# Altium project Charger_Power_2026_v2.PrjPcb
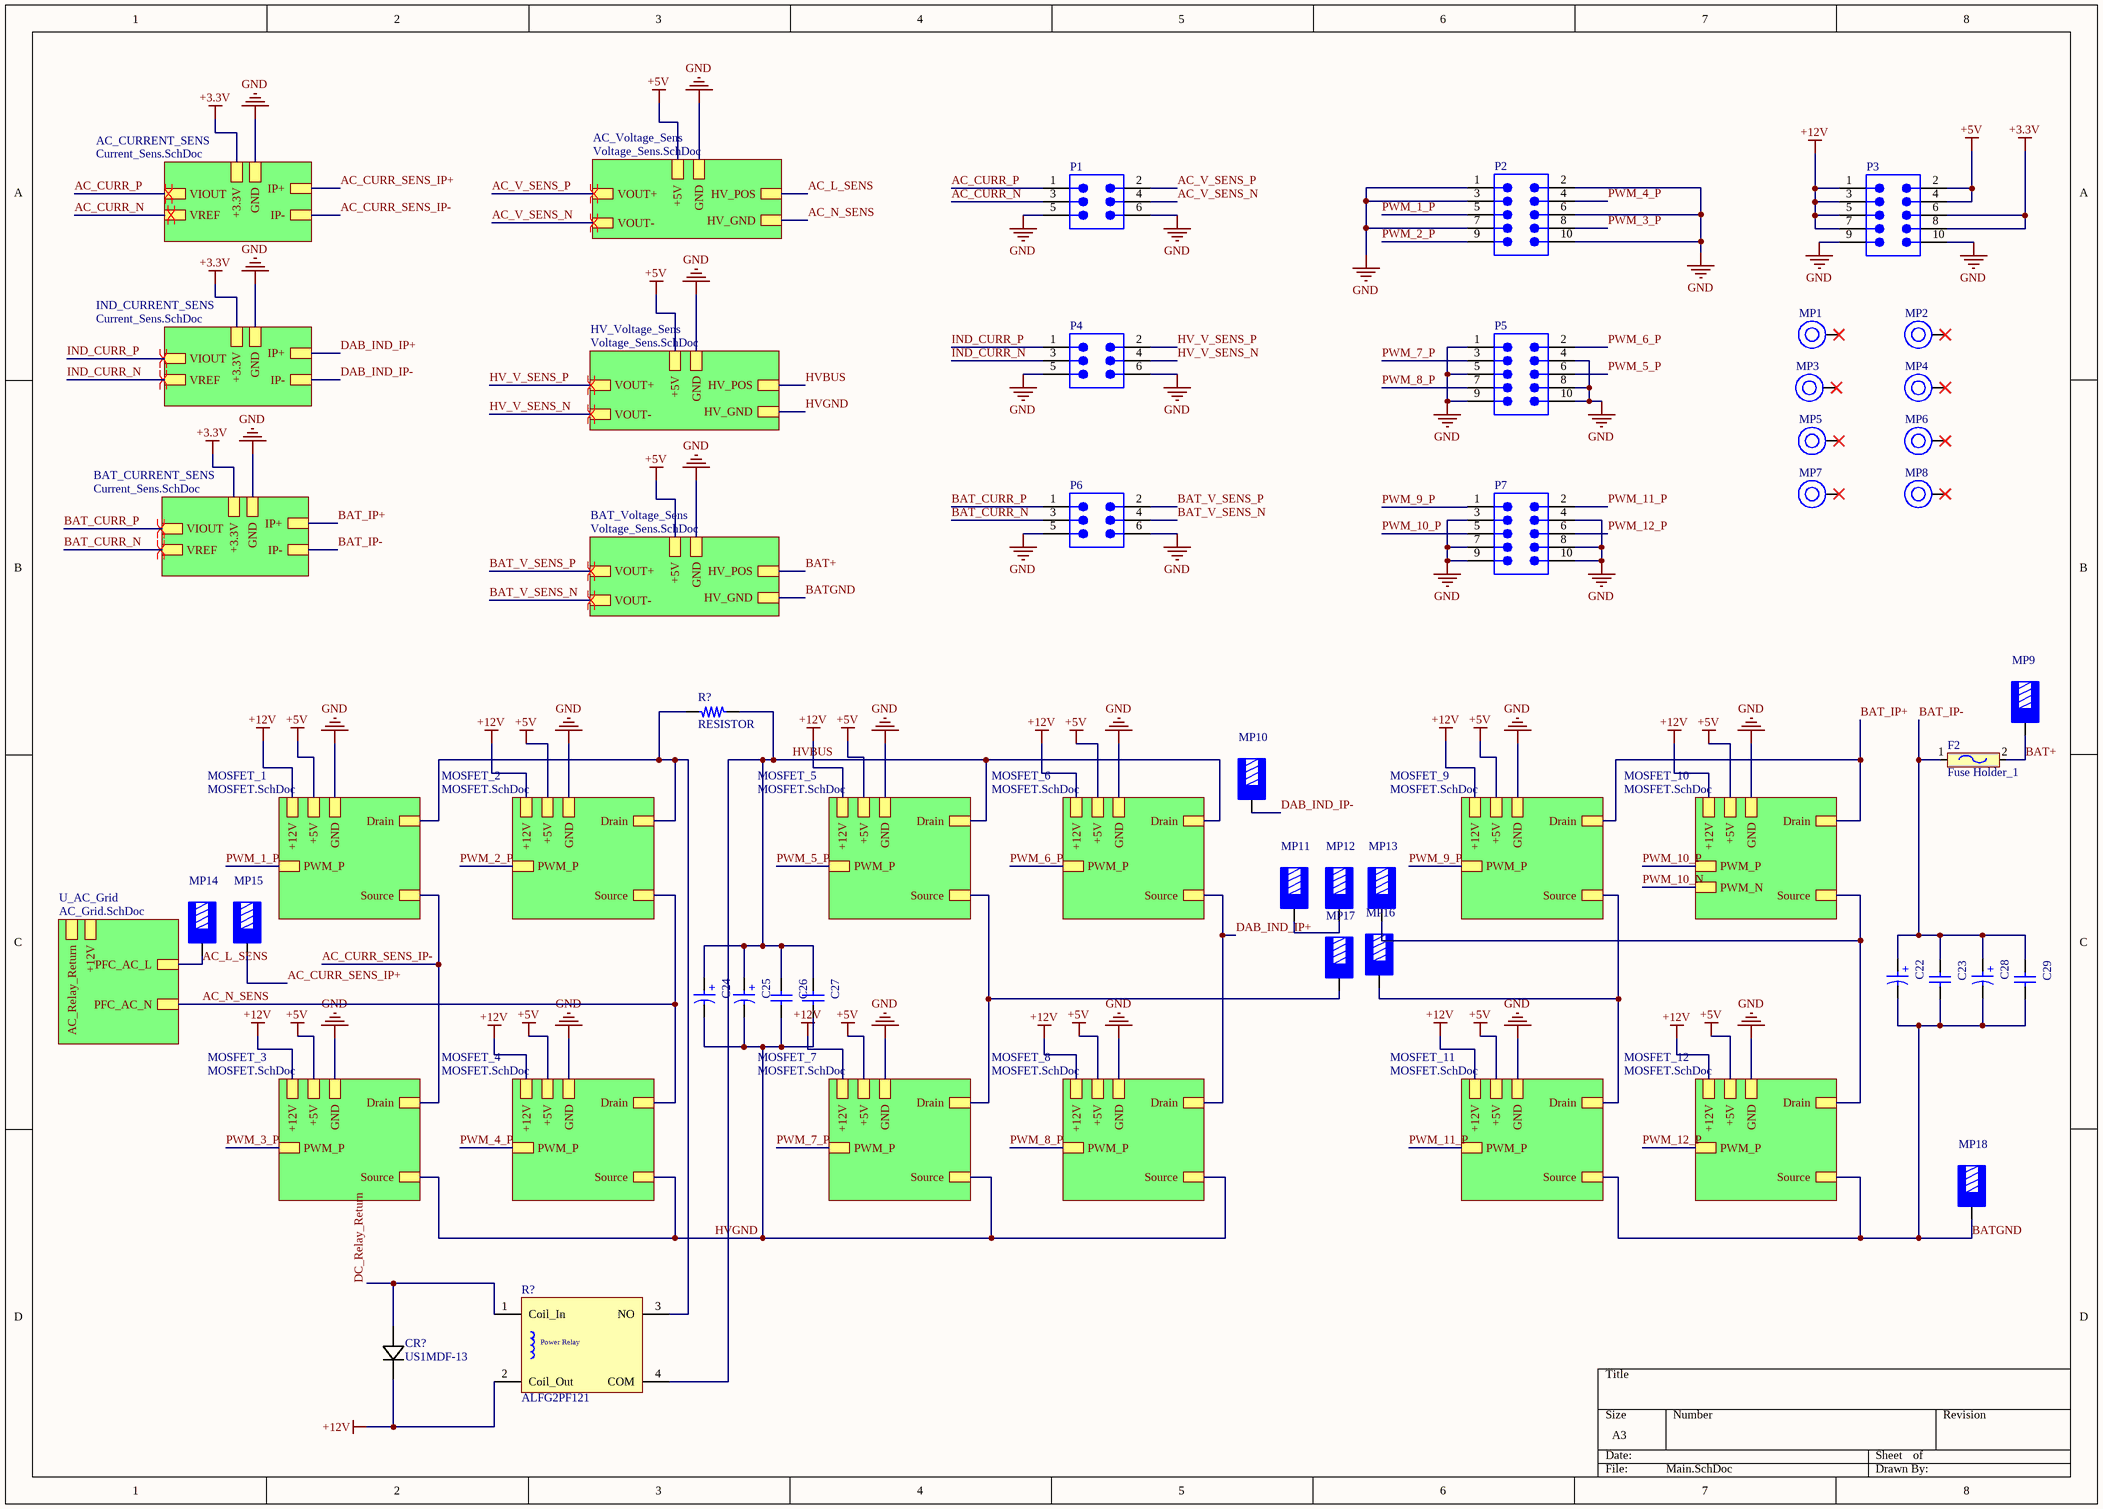
[diagram p0: Main.SchDoc]
5 sheets, 365 parts. Net scope: strictly hierarchical (ports join the sheet entries above them; power ports are local).
Board file: PCB1.PcbDoc
Sheets:
  Main.SchDoc
    U_AC_Grid = AC_Grid.SchDoc
    MOSFET_1 = MOSFET.SchDoc
    AC_Voltage_Sens = Voltage_Sens.SchDoc
    MOSFET_3 = MOSFET.SchDoc
    MOSFET_2 = MOSFET.SchDoc
    MOSFET_4 = MOSFET.SchDoc
    MOSFET_5 = MOSFET.SchDoc
    MOSFET_7 = MOSFET.SchDoc
    MOSFET_6 = MOSFET.SchDoc
    MOSFET_8 = MOSFET.SchDoc
    MOSFET_9 = MOSFET.SchDoc
    MOSFET_11 = MOSFET.SchDoc
    MOSFET_10 = MOSFET.SchDoc
    MOSFET_12 = MOSFET.SchDoc
    AC_CURRENT_SENS = Current_Sens.SchDoc
    IND_CURRENT_SENS = Current_Sens.SchDoc
    BAT_CURRENT_SENS = Current_Sens.SchDoc
    HV_Voltage_Sens = Voltage_Sens.SchDoc
    BAT_Voltage_Sens = Voltage_Sens.SchDoc

## Sheet Main.SchDoc
size A3; SheetNumber: 1; SheetTotal: 5; SPICEModelCacheLDJSNXER: <root> / <DocumentId>LDJSNXER</DocumentId> / <CacheFrame Number="0"> / <Model Name="861141486026_680uf" Kind="CKT"> / <Text>******* / .subckt 861141486026_680uF 1 2 / Rser 1 3 0.06 / Lser 2 4 1.05528512515298E-08 / C1 3 4 0.00068 / Rpar 3 4 271162.745854223 / .ends 861141486026_680uF</Text> / </Model> / <Model Name="890263425004cs_2.2uf" Kind="CKT"> / <Text>******* / .subckt 890263425004CS_2.2uF 1 2 / Rser 1 3 0.0196538190645 / Lser 2 4 1.1417797143E-08 / C1 3 4 0.0000022 / Rpar 3 4 1363636363.63636 / .ends 890263425004CS_2.2uF</Text> / </Model> / </CacheFrame> / </root>

### Parts
(Parts that share a designator on the sheet are numbered #1, #2 ... from top to bottom, then left to right.)
C22  680µF  [WCAP-AI3H_D35H55]  (value not drawn)
C23  1.5µF  [WCAP-FTBE_L31W15H24.5]  (value not drawn)
C24  680µF  [WCAP-AI3H_D35H55]  (value not drawn)
C25  680µF  [WCAP-AI3H_D35H55]  (value not drawn)
C26  1.5µF  [WCAP-FTBE_L31W15H24.5]  (value not drawn)
C27  1.5µF  [WCAP-FTBE_L31W15H24.5]  (value not drawn)
C28  680µF  [WCAP-AI3H_D35H55]  (value not drawn)
C29  1.5µF  [WCAP-FTBE_L31W15H24.5]  (value not drawn)
CR?  US1MDF-13  [DIODE_US1MDF-13_DIO-M]
F2  Fuse Holder_1  [Fuse Holder]
MP1  M3 x 10mm  [78614100360]  (value not drawn)
MP2  M3 x 10mm  [78614100360]  (value not drawn)
MP3  M3 x 10mm  [78614100360]  (value not drawn)
MP4  M3 x 10mm  [78614100360]  (value not drawn)
MP5  M3 x 10mm  [78614100360]  (value not drawn)
MP6  M3 x 10mm  [78614100360]  (value not drawn)
MP7  M3 x 10mm  [78614100360]  (value not drawn)
MP8  M3 x 10mm  [78614100360]  (value not drawn)
MP9  M4 x 6mm  [7460307_chemical surface]  (value not drawn)
MP10  M4 x 6mm  [7460307_chemical surface]  (value not drawn)
MP11  M4 x 6mm  [7460307_chemical surface]  (value not drawn)
MP12  M4 x 6mm  [7460307_chemical surface]  (value not drawn)
MP13  M4 x 6mm  [7460307_chemical surface]  (value not drawn)
MP14  M4 x 6mm  [7460307_chemical surface]  (value not drawn)
MP15  M4 x 6mm  [7460307_chemical surface]  (value not drawn)
MP16  M4 x 6mm  [7460307_chemical surface]  (value not drawn)
MP17  M4 x 6mm  [7460307_chemical surface]  (value not drawn)
MP18  M4 x 6mm  [7460307_chemical surface]  (value not drawn)
P1  61300621121  [61300621121]  (value not drawn)
P2  61301021121  [61301021121]  (value not drawn)
P3  61301021121  [61301021121]  (value not drawn)
P4  61300621121  [61300621121]  (value not drawn)
P5  61301021121  [61301021121]  (value not drawn)
P6  61300621121  [61300621121]  (value not drawn)
P7  61301021121  [61301021121]  (value not drawn)
R?#1  RESISTOR  [Power Resistor]
R?#2  ALFG2PF121  [Power Relay]

### Sub-sheets
AC_CURRENT_SENS = Current_Sens.SchDoc: +3.3V, GND, VIOUT, VREF, IP+, IP-
AC_Voltage_Sens = Voltage_Sens.SchDoc: VOUT+, VOUT-, HV_POS, HV_GND, +5V, GND
BAT_CURRENT_SENS = Current_Sens.SchDoc: +3.3V, GND, VIOUT, VREF, IP+, IP-
BAT_Voltage_Sens = Voltage_Sens.SchDoc: VOUT+, VOUT-, HV_POS, HV_GND, +5V, GND
HV_Voltage_Sens = Voltage_Sens.SchDoc: VOUT+, VOUT-, HV_POS, HV_GND, +5V, GND
IND_CURRENT_SENS = Current_Sens.SchDoc: +3.3V, GND, VIOUT, VREF, IP+, IP-
MOSFET_1 = MOSFET.SchDoc: PWM_P, Drain, Source, +12V, +5V, GND
MOSFET_2 = MOSFET.SchDoc: PWM_P, Drain, Source, +12V, +5V, GND
MOSFET_3 = MOSFET.SchDoc: PWM_P, Drain, Source, +12V, +5V, GND
MOSFET_4 = MOSFET.SchDoc: PWM_P, Drain, Source, +12V, +5V, GND
MOSFET_5 = MOSFET.SchDoc: PWM_P, Drain, Source, +12V, +5V, GND
MOSFET_6 = MOSFET.SchDoc: PWM_P, Drain, Source, +12V, +5V, GND
MOSFET_7 = MOSFET.SchDoc: PWM_P, Drain, Source, +12V, +5V, GND
MOSFET_8 = MOSFET.SchDoc: PWM_P, Drain, Source, +12V, +5V, GND
MOSFET_9 = MOSFET.SchDoc: PWM_P, Drain, Source, +12V, +5V, GND
MOSFET_10 = MOSFET.SchDoc: PWM_P, PWM_N, Drain, Source, +12V, +5V, GND
MOSFET_11 = MOSFET.SchDoc: PWM_P, Drain, Source, +12V, +5V, GND
MOSFET_12 = MOSFET.SchDoc: PWM_P, Drain, Source, +12V, +5V, GND
U_AC_Grid = AC_Grid.SchDoc: PFC_AC_L, PFC_AC_N, +12V, AC_Relay_Return

### Nets
+3.3V: P3.6 P3.8 ; sheet AC_CURRENT_SENS/+3.3V, sheet IND_CURRENT_SENS/+3.3V, sheet BAT_CURRENT_SENS/+3.3V
+5V: P3.2 P3.4 ; sheet MOSFET_1/+5V, sheet AC_Voltage_Sens/+5V, sheet MOSFET_3/+5V, sheet MOSFET_2/+5V, sheet MOSFET_4/+5V, sheet MOSFET_5/+5V, sheet MOSFET_7/+5V, sheet MOSFET_6/+5V, sheet MOSFET_8/+5V, sheet MOSFET_9/+5V, sheet MOSFET_11/+5V, sheet MOSFET_10/+5V, sheet MOSFET_12/+5V, sheet HV_Voltage_Sens/+5V, sheet BAT_Voltage_Sens/+5V
+12V: CR?.1 P3.1 P3.3 P3.5 P3.7 R?#2.2(Coil_Out) ; sheet MOSFET_1/+12V, sheet MOSFET_3/+12V, sheet MOSFET_2/+12V, sheet MOSFET_4/+12V, sheet MOSFET_5/+12V, sheet MOSFET_7/+12V, sheet MOSFET_6/+12V, sheet MOSFET_8/+12V, sheet MOSFET_9/+12V, sheet MOSFET_11/+12V, sheet MOSFET_10/+12V, sheet MOSFET_12/+12V
AC_L_SENS: MP14.1 ; sheet U_AC_Grid/PFC_AC_L, sheet AC_Voltage_Sens/HV_POS
AC_N_SENS: sheet U_AC_Grid/PFC_AC_N, sheet AC_Voltage_Sens/HV_GND, sheet MOSFET_2/Source, sheet MOSFET_4/Drain
BAT+: F2.2(VCC26) MP9.1 ; sheet BAT_Voltage_Sens/HV_POS
BATGND: C22.2(N) C23.2 C28.2(N) C29.2 MP18.1 ; sheet MOSFET_11/Source, sheet MOSFET_12/Source, sheet BAT_Voltage_Sens/HV_GND
GND: P1.5 P1.6 P2.1 P2.2 P2.3 P2.6 P2.7 P2.10 P3.9 P3.10 P4.5 P4.6 P5.1 P5.4 P5.5 P5.8 P5.9 P5.10 P6.5 P6.6 P7.3 P7.4 P7.7 P7.8 P7.9 P7.10 ; sheet MOSFET_1/GND, sheet AC_Voltage_Sens/GND, sheet MOSFET_3/GND, sheet MOSFET_2/GND, sheet MOSFET_4/GND, sheet MOSFET_5/GND, sheet MOSFET_7/GND, sheet MOSFET_6/GND, sheet MOSFET_8/GND, sheet MOSFET_9/GND, sheet MOSFET_11/GND, sheet MOSFET_10/GND, sheet MOSFET_12/GND, sheet AC_CURRENT_SENS/GND, sheet IND_CURRENT_SENS/GND, sheet BAT_CURRENT_SENS/GND, sheet HV_Voltage_Sens/GND, sheet BAT_Voltage_Sens/GND
HVBUS: C24.1(P) C25.1(P) C26.1 C27.1 R?#1.2(BOT) R?#2.4(COM) ; sheet MOSFET_5/Drain, sheet MOSFET_6/Drain, sheet HV_Voltage_Sens/HV_POS
HVGND: C24.2(N) C25.2(N) C26.2 C27.2 ; sheet MOSFET_3/Source, sheet MOSFET_4/Source, sheet MOSFET_7/Source, sheet MOSFET_8/Source, sheet HV_Voltage_Sens/HV_GND
AC_CURR_N: P1.3 ; sheet AC_CURRENT_SENS/VREF
AC_CURR_P: P1.1 ; sheet AC_CURRENT_SENS/VIOUT
AC_CURR_SENS_IP+: MP15.1 ; sheet AC_CURRENT_SENS/IP+
AC_CURR_SENS_IP-: sheet MOSFET_1/Source, sheet MOSFET_3/Drain, sheet AC_CURRENT_SENS/IP-
AC_V_SENS_N: P1.4 ; sheet AC_Voltage_Sens/VOUT-
AC_V_SENS_P: P1.2 ; sheet AC_Voltage_Sens/VOUT+
BAT_CURR_N: P6.3 ; sheet BAT_CURRENT_SENS/VREF
BAT_CURR_P: P6.1 ; sheet BAT_CURRENT_SENS/VIOUT
BAT_IP+: sheet MOSFET_9/Drain, sheet MOSFET_10/Drain, sheet BAT_CURRENT_SENS/IP+
BAT_IP-: C22.1(P) C23.1 C28.1(P) C29.1 F2.1(VCC27) ; sheet BAT_CURRENT_SENS/IP-
BAT_V_SENS_N: P6.4 ; sheet BAT_Voltage_Sens/VOUT-
BAT_V_SENS_P: P6.2 ; sheet BAT_Voltage_Sens/VOUT+
DAB_IND_IP+: sheet MOSFET_6/Source, sheet MOSFET_8/Drain, sheet IND_CURRENT_SENS/IP+
DAB_IND_IP-: MP10.1 ; sheet IND_CURRENT_SENS/IP-
DC_Relay_Return: CR?.2 R?#2.1(Coil_In)
Drain: MP17.1 ; sheet MOSFET_5/Source, sheet MOSFET_7/Drain
Drain: MP13.1 ; sheet MOSFET_10/Source, sheet MOSFET_12/Drain  [a separate net that carries the same name]
Drain: MP16.1 ; sheet MOSFET_9/Source, sheet MOSFET_11/Drain  [a separate net that carries the same name]
Drain: R?#1.1(TOP) R?#2.3(NO) ; sheet MOSFET_1/Drain, sheet MOSFET_2/Drain  [a separate net that carries the same name]
HV_V_SENS_N: P4.4 ; sheet HV_Voltage_Sens/VOUT-
HV_V_SENS_P: P4.2 ; sheet HV_Voltage_Sens/VOUT+
IND_CURR_N: P4.3 ; sheet IND_CURRENT_SENS/VREF
IND_CURR_P: P4.1 ; sheet IND_CURRENT_SENS/VIOUT
PWM_1_P: P2.5 ; sheet MOSFET_1/PWM_P
PWM_2_P: P2.9 ; sheet MOSFET_2/PWM_P
PWM_3_P: P2.8 ; sheet MOSFET_3/PWM_P
PWM_4_P: P2.4 ; sheet MOSFET_4/PWM_P
PWM_5_P: P5.6 ; sheet MOSFET_5/PWM_P
PWM_6_P: P5.2 ; sheet MOSFET_6/PWM_P
PWM_7_P: P5.3 ; sheet MOSFET_7/PWM_P
PWM_8_P: P5.7 ; sheet MOSFET_8/PWM_P
PWM_9_P: P7.1 ; sheet MOSFET_9/PWM_P
PWM_10_N: sheet MOSFET_10/PWM_N
PWM_10_P: P7.5 ; sheet MOSFET_10/PWM_P
PWM_11_P: P7.2 ; sheet MOSFET_11/PWM_P
PWM_12_P: P7.6 ; sheet MOSFET_12/PWM_P
NetMP11_1: MP11.1 MP12.1

Not connected (* = marked no-connect by the designer): MP1 1*; MP2 1*; MP3 1*; MP4 1*; MP5 1*; MP6 1*; MP7 1*; MP8 1*

### Layout directives
differential pair: AC_CURR_N, AC_CURR_P, AC_V_SENS_N, AC_V_SENS_P, BAT_CURR_N, BAT_CURR_P, BAT_V_SENS_N, BAT_V_SENS_P, HV_V_SENS_N, HV_V_SENS_P, IND_CURR_N, IND_CURR_P

### Notes on the sheet
- (in symbol 861141486026) +

### Library data of the parts
C22 C24 C25 C28 = 861141486026: WCAP-AI3H Aluminum Electrolytic Capacitor, THT, D35 x H55mm, 680µF, 450V; Manufacturer: Wurth Elektronik; Dissipation Factor: 20%; Endurance: 3000h; Leakage Current: 1659.52µA; Ripple Current: 2200mA; Manufacturer Part Number: 861141486026; Category: Aluminum Electrolytic Capacitors; Match Code: WCAP-AI3H; ComponentLink1Description: Website Link; ComponentLink1URL: https://www.we-online.com/redexpert/article/861141486026?ad; ComponentLink2Description: Datasheet Link; ComponentLink2URL: https://www.we-online.com/redexpert/spec/861141486026?ad; Mount: Through Hole; Min Operating Temperature: -25°C; Max Operating Temperature: 105°C; Packaging: Tray; Height: 55mm; Diameter: 35mm; Capacitance: 680µF; Lead Pitch: 10mm; Rated Voltage (DC): 450V
C23 C26 C27 C29 = 890303427009CS: WCAP-FTBE Film Capacitor, THT, L31 x W15 x H24.5mm, 1.5µF, 630V; Manufacturer: Wurth Elektronik; Dissipation Factor @1kHz: 1%; Insulation Resistance: 2GΩ; Rate of Voltage Rise: 17V/µs; Rated Voltage @85degC: 630V (DC); Rated Voltage @105degC: 504V (DC); Manufacturer Part Number: 890303427009CS; Category: Film Capacitors; Match Code: WCAP-FTBE; ComponentLink1Description: Website Link; ComponentLink1URL: https://www.we-online.com/redexpert/article/890303427009CS?ad; ComponentLink2Description: Datasheet Link; ComponentLink2URL: https://www.we-online.com/redexpert/spec/890303427009CS?ad; Mount: Through Hole; Min Operating Temperature: -40°C; Max Operating Temperature: 85°C; Packaging: Carton; Length: 31mm; Width: 15mm; Height: 24.5mm; Capacitance: 1.5µF
CR? = US1MDF-13: No Description Available; Mfr_Name: Diodes Inc; Type: DEV; Copyright: Copyright (C) 2021 Ultra Librarian. All rights reserved.; Manufacturer_Part_Number: US1MDF-13; RefDes: RefDes
MP1-MP8 = 78614100360: WA-SMSA SMT Spacer Studs Automotive, OD 6mm, ID 4.2mm, M3 x 10mm; Manufacturer: Wurth Elektronik; Surface: Tin; Solder Cream Thickness Min: 150um; Tightenning Torque Max: 0.5N*m; Manufacturer Part Number: 78614100360; Category: SMT Spacers; Match Code: WA-SMSA; ComponentLink1Description: Website Link; ComponentLink1URL: https://www.we-online.com/redexpert/article/78614100360?ad; ComponentLink2Description: Datasheet Link; ComponentLink2URL: https://www.we-online.com/redexpert/spec/78614100360?ad; Mount: Surface Mount; Min Operating Temperature: -55°C; Max Operating Temperature: 150°C; Packaging: Tape and Reel; Height: 10mm; Automotive: Yes; Inside Diameter: 4.2mm; Material: Steel; Outside Diameter: 6mm; Thread Size: M3
MP9-MP18 = 7460307: WP-BUTR REDCUBE PRESS-FIT with internal thread, two-rows, L9W9H7mm, M4 x 6mm, 160A; Manufacturer: Wurth Elektronik; Surface: Tin; Manufacturer Part Number: 7460307; Category: REDCUBE PRESS-FIT; Match Code: WP-BUTR; ComponentLink1Description: Website Link; ComponentLink1URL: https://www.we-online.com/redexpert/article/7460307?ad; ComponentLink2Description: Datasheet Link; ComponentLink2URL: https://www.we-online.com/redexpert/spec/7460307?ad; Mount: Press Fit; Min Operating Temperature: -55°C; Max Operating Temperature: 150°C; Packaging: Bulk; Length: 9mm; Width: 9mm; Height: 7mm; Material: Brass; Number of Pins: 8; Rated Current: 160A; Thread Length: 6mm; Thread Size: M4
P1 P4 P6 = 61300621121: WR-PHD Pin Header, THT, Vertical, pitch 2.54mm, 2 Row, 6P; Manufacturer: Wurth Elektronik; Contact Resistance: 20mOhm; Rated Current: 3A; Working Voltage: 250V; Withstanding Voltage: 500V; Manufacturer Part Number: 61300621121; Category: Board-to-Board Connectors; Match Code: WR-PHD; ComponentLink1Description: Website Link; ComponentLink1URL: https://www.we-online.com/redexpert/article/61300621121?ad; ComponentLink2Description: Datasheet Link; ComponentLink2URL: https://www.we-online.com/redexpert/spec/61300621121?ad; Mount: Through Hole; Min Operating Temperature: -40°C; Max Operating Temperature: 105°C; Packaging: Bag; Gender: Pin Header; Number of Pins: 6; Number of Rows: 2; Orientation: Vertical; Lead Pitch: 2.54mm
P2 P3 P5 P7 = 61301021121: WR-PHD Pin Header, THT, Vertical, pitch 2.54mm, 2 Row, 10P; Manufacturer: Wurth Elektronik; Contact Resistance: 20mOhm; Rated Current: 3A; Working Voltage: 250V; Withstanding Voltage: 500V; Manufacturer Part Number: 61301021121; Category: Board-to-Board Connectors; Match Code: WR-PHD; ComponentLink1Description: Website Link; ComponentLink1URL: https://www.we-online.com/redexpert/article/61301021121?ad; ComponentLink2Description: Datasheet Link; ComponentLink2URL: https://www.we-online.com/redexpert/spec/61301021121?ad; Mount: Through Hole; Min Operating Temperature: -40°C; Max Operating Temperature: 105°C; Packaging: Bag; Gender: Pin Header; Number of Pins: 10; Number of Rows: 2; Orientation: Vertical; Lead Pitch: 2.54mm
R?#1 = RESISTOR: Manufacturer: TE CONNECTIVITY; Manufacturer Part Number: 352124KFT; Product Range: 3520 Series; Resistance: 24; Power Rating: 2; Resistance Tolerance: ± 1%; Voltage Rating: 250; Resistor Case Style: 2512 [6432 Metric]; Temperature Coefficient: ± 100; SVHC: No SVHC (15-Jun-2015); Resistor Mounting: SMD<!--FANDB--><div class="features-and-benefits-container"></div>; Supplier 1: Farnell; RoHS: YES; Stock 1: 6653; Pricing 1: 1=0.481, 150=0.1603, 400=0.1374, 1000=0.1069, 2000=0.0875, 4000=0.0764, 20000=0.0749, 40000=0.0733 (GBP); Packaging: Cut Tape; Resistor Element Material: -; MSL: -; ComponentLink1URL: http://www.farnell.com/datasheets/1610601.pdf; ComponentLink1Description: http://www.farnell.com/datasheets/1610601.pdf
R?#2 = Power Relay

## Sheet AC_Grid.SchDoc
size A4; SheetNumber: 3; SheetTotal: 5; SPICEModelCacheEYTXZMXP: <root> / <DocumentId>EYTXZMXP</DocumentId> / <CacheFrame Number="0"> / <Model Name="xl_744830017132_1.7m" Kind="CKT"> / <Text>*-------------------------------------------------------- / .subckt XL_744830017132_1.7m 1 2 3 4 / R1 N004 1 {Rdc} / R2 N006 N004 {dR4} / C1 N005 N004 {dC3} / L1 N011 N004 {dL3} / L2 N018 N019 {dL3} / C2 N011 N019 {ck} / R3 N006 N005 {dR3} / R4 N020 N022 {dR3} / C3 N022 N018 {dC3} / R5 N020 N018 {dR4} / L3 N006 N011 {dL3} / L4 N019 N020 {dL3} / R6 N018 2 {Rdc} / R8 N001 N006 {dR6} / C4 N007 N006 {dC4} / L5 N012 N006 {dL4} / L6 N020 N021 {dL4} / C5 N012 N021 {ck} / R9 N001 N007 {dR5} / R10 N013 N023 {dR5} / C6 N023 N020 {dC4} / R11 N013 N020 {dR6} / L7 N001 N012 {dL4} / L8 N021 N013 {dL4} / L9 N009 N008 {L3} / C7 N003 N002 {C1} / R13 N009 N008 {Rs3} / L10 4 N010 {L1} / R14 4 N010 {Rs1} / L11 N010 N009 {L2} / R15 N010 N009 {Rs2} / L12 N016 N015 {L3} / C8 N024 N014 {C1} / L13 3 N017 {L1} / L14 N017 N016 {L2} / R16 4 N003 {R2} / R17 3 N024 {R2} / L15 N015 N014 {L4} / R18 N008 N002 {Rs4} / L16 N008 N002 {L4} / R21 3 N017 {Rs1} / R22 N017 N016 {Rs2} / R23 N016 N015 {Rs3} / R24 N015 N014 {Rs4} / R25 N002 N001 {Rs5} / R26 N014 N013 {Rs5} / C9 N002 N001 {C2} / C10 N014 N013 {C2} / L17 N002 N001 {L5} / L18 N014 N013 {L5} / K7 L1 L3 L2 L4 0.9999 / K6 L5 L7 L6 L8 0.9999 / K3 L9 L12 1 / K2 L11 L14 1 / K1 L10 L13 1 / K4 L16 L15 1 / K5 L17  L18 1 / .param Rdc=0.01 / .param L1=1760.38e-006 / .param L2=700.35e-006 / .param L3=95.47e-006 / .param L4=99.22e-006 / .param L5=2.5e-010 / .param C1=1.98e-011 / .param C2=3e-016 / .param Rs1=12128 / .param Rs2=837 / .param Rs3=1493 / .param Rs4=1378 / .param Rs5=7490 / .param R2=17 / .param dL3=70e-08 / .param dC3=20e-012 / .param dL4=9.51e-09 / .param dC4=10e-09 / .param dR3=0.19 / .param dR4=4950 / .param dR5=1 / .param dR6=200 / .param ck=0.2pF / .backanno / .ends XL_744830017132_1.7m</Text> / </Model> / <Model Name="890303427009cs_1.5uf" Kind="CKT"> / <Text>******* / .subckt 890303427009CS_1.5uF 1 2 / Rser 1 3 0.0275799803666 / Lser 2 4 1.6818559318E-08 / C1 3 4 0.0000015 / Rpar 3 4 2000000000 / .ends 890303427009CS_1.5uF</Text> / </Model> / <Model Name="1812_8853522110011_470pf" Kind="CKT"> / <Text>******* / .subckt 1812_8853522110011_470pF 1 2 / Rser 1 3 0.235 / Lser 2 4 0.000000000505 / C1 3 4 0.00000000047 / Rpar 3 4 100000000000 / .ends 1812_8853522110011_470pF</Text> / </Model> / </CacheFrame> / </root>
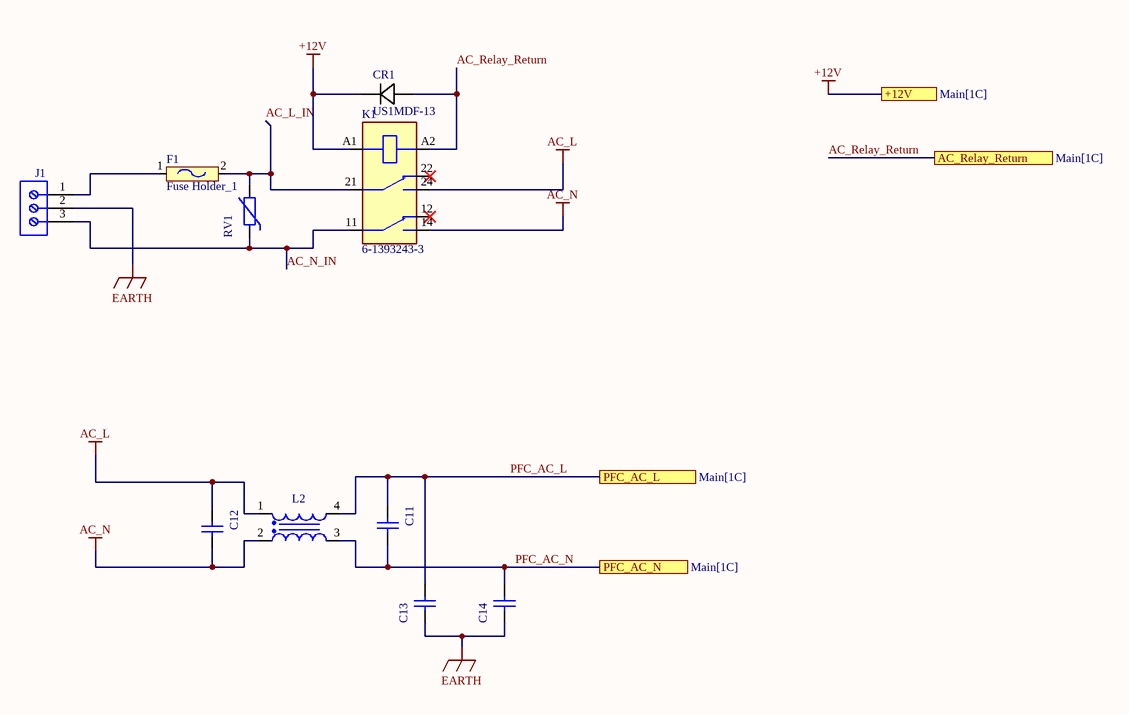
[diagram p1: AC_Grid.SchDoc]

### Parts
C11  1µF  [WCAP-FTBE_L26W9H18]  (value not drawn)
C12  1µF  [WCAP-FTBE_L26W9H18]  (value not drawn)
C13  470 pF  [WCAP-CSSA_1812_8853522110011]  (value not drawn)
C14  470 pF  [WCAP-CSSA_1812_8853522110011]  (value not drawn)
CR1  US1MDF-13  [DIODE_US1MDF-13_DIO-M]
F1  Fuse Holder_1  [Fuse Holder]
J1  691250610003  [691250610003]  (value not drawn)
K1  6-1393243-3  [RELAY_6-1393243-3]
L2  1.7mH  [WE-CMB HV_Type XL_744830017132]  (value not drawn)
RV1  275Vrms, 350Vdc  [D16.5W6.7H20P1.3]  (value not drawn)

### Ports
+12V (see Main[1C]), AC_Relay_Return (see Main[1C]), PFC_AC_L (see Main[1C]), PFC_AC_N (see Main[1C])

### Nets
+12V: CR1.1 K1.A1 ; port +12V
AC_L: C12.1 K1.24 L2.1
AC_N: C12.2 K1.14 L2.2
EARTH: C13.1 C14.1 J1.2
PFC_AC_L: C11.1 C13.2 L2.4 ; port PFC_AC_L  [project net AC_L_SENS]
PFC_AC_N: C11.2 C14.2 L2.3 ; port PFC_AC_N  [project net AC_N_SENS]
AC_L_IN: F1.2(VCC26) K1.21 RV1.2
AC_N_IN: J1.3 K1.11 RV1.1
AC_Relay_Return: CR1.2 K1.A2 ; port AC_Relay_Return
NetF1_1: F1.1(VCC27) J1.1

Not connected (* = marked no-connect by the designer): K1 12* 22*

### Library data of the parts
C11 C12 = 890283426008CS: WCAP-FTBE Film Capacitor, THT, L26 x W9 x H18mm, 1µF, 400V; Manufacturer: Wurth Elektronik; Dissipation Factor @1kHz: 1%; Insulation Resistance: 3GΩ; Rate of Voltage Rise: 13V/µs; Rated Voltage @85degC: 400V (DC); Rated Voltage @105degC: 320V (DC); Manufacturer Part Number: 890283426008CS; Category: Film Capacitors; Match Code: WCAP-FTBE; ComponentLink1Description: Website Link; ComponentLink1URL: https://www.we-online.com/redexpert/article/890283426008CS?ad; ComponentLink2Description: Datasheet Link; ComponentLink2URL: https://www.we-online.com/redexpert/spec/890283426008CS?ad; Mount: Through Hole; Min Operating Temperature: -40°C; Max Operating Temperature: 85°C; Packaging: Carton; Length: 26mm; Width: 9mm; Height: 18mm; Capacitance: 1µF
C13 C14 = 8853522110011: WCAP-CSSA Multilayer Ceramic Chip Safety Capacitor, SMT, size 1812, X7R Class II, 470 pF, 250 V (AC); Manufacturer: Wurth Elektronik; Case/Size Code: 1812; Capacitance Tolerance: ±10%; Dissipation Factor: 2.5%; Impulse Voltage: 5000 V (DC); Insulation Resistance: 10 GΩ; Safety Class: X1 / Y2; Manufacturer Part Number: 8853522110011; Category: Multilayer Ceramic Chip Capacitors; Match Code: WCAP-CSSA; ComponentLink1Description: Website Link; ComponentLink1URL: https://www.we-online.com/redexpert/article/8853522110011?ad; ComponentLink2Description: Datasheet Link; ComponentLink2URL: https://www.we-online.com/redexpert/spec/8853522110011?ad; Mount: Surface Mount; Min Operating Temperature: -55 °C; Max Operating Temperature: 125 °C; Packaging: Tape and Reel; Length: 4.5 mm; Width: 3.2 mm; Height: 1.6 mm; Capacitance: 470 pF; Ceramic Type: X7R Class II; Rated Voltage: 250 V (AC)
CR1 = US1MDF-13: as CR? on sheet Main; Copyright: Copyright (C) 2021 Ultra Librarian. All rights reserved.; Manufacturer_Part_Number: US1MDF-13; RefDes: RefDes
J1 = 691250610003: WR-TBL Series 2506 Horizontal Entry Modular, THT, pitch 6.35mm, 03p; Manufacturer: Wurth Elektronik; Modularity: Yes; Rated Current: 24A; System: Rising Cage Clamp; Working Voltage: 300V; Manufacturer Part Number: 691250610003; Category: Terminal Block; Match Code: WR-TBL; ComponentLink1Description: Website Link; ComponentLink1URL: https://www.we-online.com/redexpert/article/691250610003?ad; ComponentLink2Description: Datasheet Link; ComponentLink2URL: https://www.we-online.com/redexpert/spec/691250610003?ad; Mount: Through Hole; Min Operating Temperature: -30°C; Max Operating Temperature: 120°C; Packaging: Box; Application: Rising Cage Clamp; Number of Pins: 3; Number of Rows: 1; Orientation: Horizontal; Lead Pitch: 6.35mm
K1 = 6-1393243-3: General Purpose Relay DPDT (2 Form C) 12VDC Coil Through Hole; MF: TE Connectivity; SnapEDA_Link: https://www.snapeda.com/parts/6-1393243-3/TE+Connectivity+Potter+%2526+Brumfield+Relays/view-part/?ref=snap; Package: None; Value: *; MP: 6-1393243-3; Check_prices: https://www.snapeda.com/parts/6-1393243-3/TE+Connectivity+Potter+%2526+Brumfield+Relays/view-part/?ref=eda
L2 = 744830017132: WE-CMB HV Common Mode Power Line Choke, THT, Type XL, 1.7mH, 13.2A, 10mOhm; Manufacturer: Wurth Elektronik; Case/Size Code: Type XL; Insulation Test Voltage (AC): 3000V; Material: MnZn; Rated Voltage (AC): 760V; Manufacturer Part Number: 744830017132; Category: Common Mode Chokes; Match Code: WE-CMB HV; ComponentLink1Description: Website Link; ComponentLink1URL: https://www.we-online.com/redexpert/article/744830017132?ad; ComponentLink2Description: Datasheet Link; ComponentLink2URL: https://www.we-online.com/redexpert/spec/744830017132?ad; Mount: Through Hole; Min Operating Temperature: -40°C; Max Operating Temperature: 125°C; Packaging: Tray; Length: 40mm; Width: 23mm; Height: 39.5mm; DC Resistance Max: 10mOhm; Inductance: 1.7mH; Rated Current: 13.2A
RV1 = 820542711: WE-VD Disk Varistor, THT, D16.5mm x H20mm, 275Vrms, 350Vdc, 4500A, 132J; Manufacturer: Wurth Elektronik; Operating Voltage (AC): 275V; Operating Voltage (DC): 350V; Power Dissipation: 0.6W; (Reverse) Breakdown Voltage: 430V; VDE Approval: Yes; Manufacturer Part Number: 820542711; Category: Surge Protection; Match Code: WE-VD; ComponentLink1Description: Website Link; ComponentLink1URL: https://www.we-online.com/redexpert/article/820542711?ad; ComponentLink2Description: Datasheet Link; ComponentLink2URL: https://www.we-online.com/redexpert/spec/820542711?ad; Mount: Through Hole; Min Operating Temperature: -40°C; Max Operating Temperature: 105°C; Packaging: Tape and Reel; Width: 6.7mm; Height: 20mm; Diameter: 16.5mm; Energy Absorption: 132J; (Reverse) Peak Pulse Current: 4500A

## Sheet MOSFET.SchDoc
size A4; SheetNumber: 2; SheetTotal: 5; SPICEModelCacheWFDLOHPZ: <root> / <DocumentId>WFDLOHPZ</DocumentId> / <CacheFrame Number="0"> / <Model Name="6033_7447785006_6.8u" Kind="CKT"> / <Text>******* / .subckt 6033_7447785006_6.8u 1 2 / Rp 1 2 8506.21069778 / Cp 1 2 2.12954534656p / Rs 1 N3 0.079 / L1 N3 2 6.05071959927u / .ends 6033_7447785006_6.8u</Text> / </Model> / <Model Name="1808_8853620100181_220pf" Kind="CKT"> / <Text>******* / .subckt 1808_8853620100181_220pF 1 2 / Rser 1 3 0.0587493769172 / Lser 2 4 0.00000000095 / C1 3 4 0.00000000022 / Rpar 3 4 100000000000 / .ends 1808_8853620100181_220pF</Text> / </Model> / <Model Name="0805_150080rs75000" Kind="CKT"> / <Text>****** / .subckt 0805_150080RS75000  1  2 / D1 1 2 SMCW / .MODEL SMCW D / + IS=10.000E-21 / + N=1.6992 / + RS=1.0000E-6 / + IKF=1.2373E-3 / + CJO=1.0000E-12 / + M=.3333 / + VJ=.75 / + BV=5 / + IBV=10.00E-6 / + TT=5.0000E-9 / .ends</Text> / </Model> / </CacheFrame> / </root>
Used 12 times, as channels MOSFET_1, MOSFET_3, MOSFET_2, MOSFET_4, MOSFET_5, MOSFET_7, MOSFET_6, MOSFET_8, MOSFET_9, MOSFET_11, MOSFET_10, MOSFET_12. Parts and nets are listed once, with the designators drawn on the sheet.
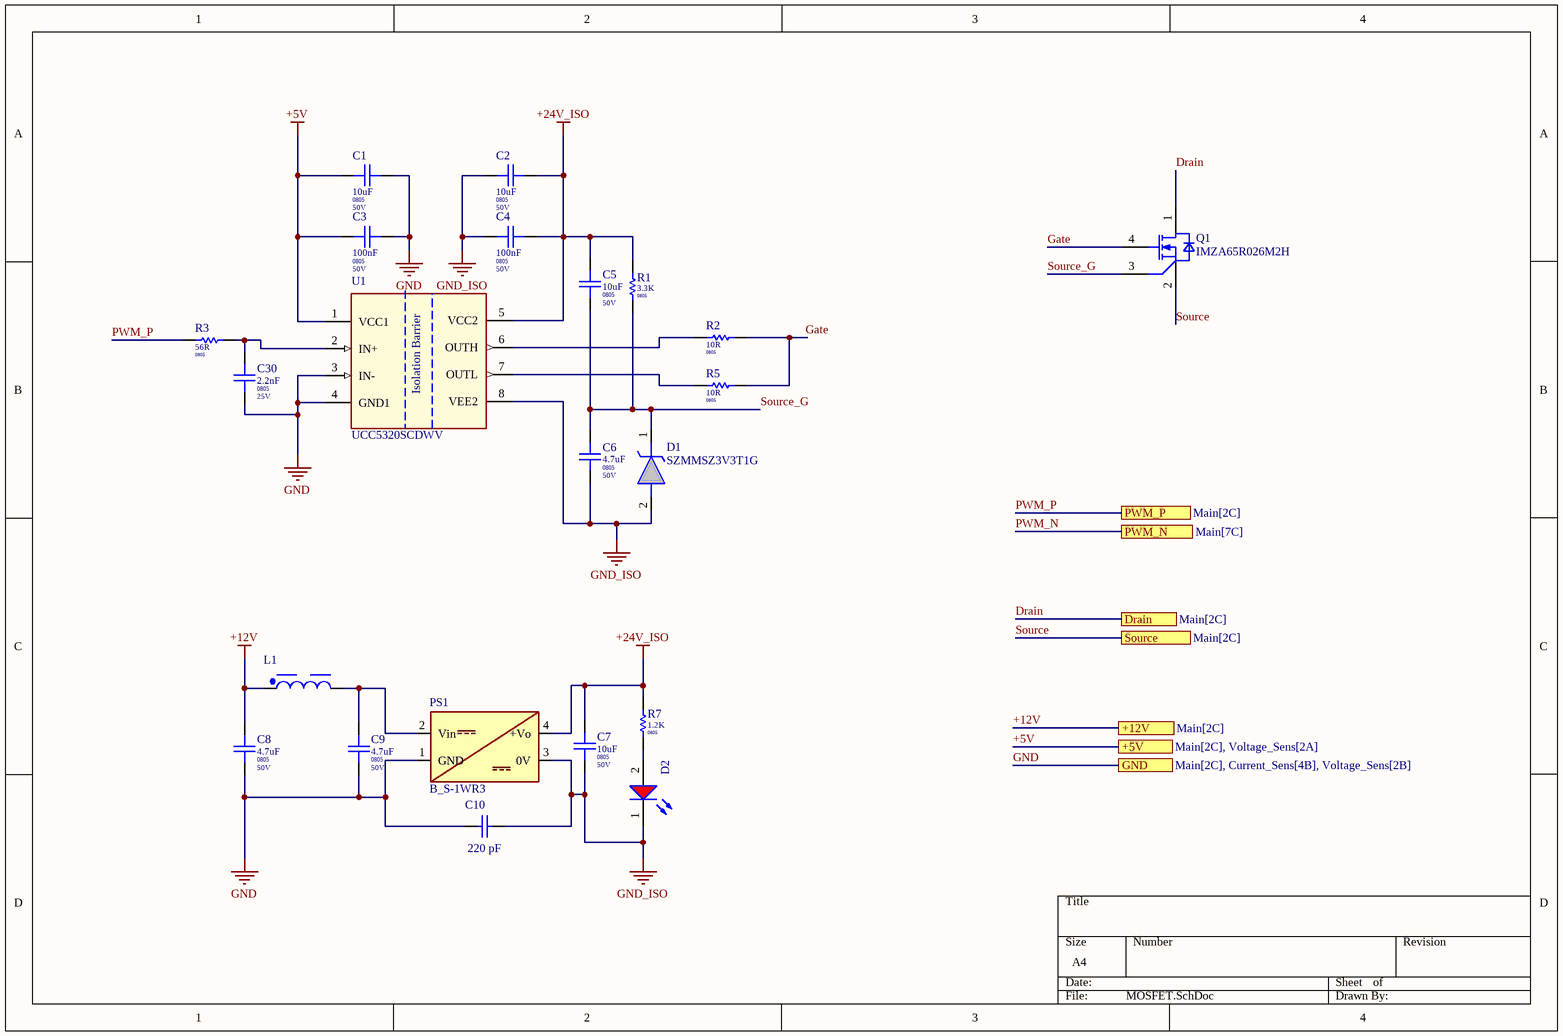
[diagram p2: MOSFET.SchDoc]

### Parts
C1  Package / Case: 0805  Voltage: 50V  [CAPC 0805]  (hidden comment: 10uF)
C2  Package / Case: 0805  Voltage: 50V  [CAPC 0805]  (hidden comment: 10uF)
C3  Package / Case: 0805  Voltage: 50V  [CAPC 0805]  (hidden comment: 100nF)
C4  Package / Case: 0805  Voltage: 50V  [CAPC 0805]  (hidden comment: 100nF)
C5  Package / Case: 0805  Voltage: 50V  [CAPC 0805]  (hidden comment: 10uF)
C6  Package / Case: 0805  Voltage: 50V  [CAPC 0805]  (hidden comment: 4.7uF)
C7  Package / Case: 0805  Voltage: 50V  [CAPC 0805]  (hidden comment: 10uF)
C8  Package / Case: 0805  Voltage: 50V  [CAPC 0805]  (hidden comment: 4.7uF)
C9  Package / Case: 0805  Voltage: 50V  [CAPC 0805]  (hidden comment: 4.7uF)
C10  220 pF  [WCAP-CSSA_1808_8853620100181]
C30  Package / Case: 0805  Voltage: 25V  [CAPC 0805]  (hidden comment: 2.2nF)
D1  SZMMSZ3V3T1G  [SOD3716X135N]
D2  Red, 2V, 140°  [WL-SMCW_0805_150080xx75000]  (value not drawn)
L1  6.8μH  [WE-PD_6033R]  (value not drawn)
PS1  B_S-1WR3  [B_S-1WR3]
Q1  IMZA65R026M2H  [INF-PG-TO247-4-3]
R1  Package / Case: 0805  [RESC 0805]  (hidden comment: 3.3K)
R2  Package / Case: 0805  [RESC 0805]  (hidden comment: 10R)
R3  Package / Case: 0805  [RESC 0805]  (hidden comment: 56R)
R5  Package / Case: 0805  [RESC 0805]  (hidden comment: 10R)
R7  Package / Case: 0805  [RESC 0805]  (hidden comment: 1.2K)
U1  UCC5320SCDWV  [DWV0008A]

### Ports
+5V (see Main[2C], Voltage_Sens[2A]), +12V (see Main[2C]), Drain (see Main[2C]), GND (see Main[2C], Current_Sens[4B], Voltage_Sens[2B]), PWM_N (see Main[7C]), PWM_P (see Main[2C]), Source (see Main[2C])

### Nets
+5V: C1.1 C3.1 U1.1(VCC1) ; port +5V
+12V: C8.2 L1.1 ; port +12V
+24V_ISO: C2.2 C4.2 C5.2 C7.2 PS1.4(+Vo) R1.2 R7.2 U1.5(VCC2)
GND: C1.2 C3.2 C8.1 C9.1 C10.1 C30.1 PS1.1(GND) U1.3(IN-) U1.4(GND1) ; port GND
GND_ISO: C2.1 C4.1 C6.1 C7.1 C10.2 D1.2(A) D2.1(K) PS1.3(0V) U1.8(VEE2)
Drain: Q1.1(DRAIN) ; port Drain
Gate: Q1.4(GATE) R2.2 R5.2
PWM_N: port PWM_N
PWM_P: R3.1 ; port PWM_P
Source: Q1.2(SOURCE1) ; port Source
Source_G: C5.1 C6.2 D1.1(K) Q1.3(SOURCE2) R1.1
NetC9_2: C9.2 L1.2 PS1.2(Vin)
NetC30_2: C30.2 R3.2 U1.2(IN+)
NetD2_2: D2.2(A) R7.1
NetR2_1: R2.1 U1.6(OUTH)
NetR5_1: R5.1 U1.7(OUTL)

### Channels
MOSFET_1: designators end in _MOSFET_1; ports +5V=+5V +12V=+12V Drain=Drain GND=GND PWM_N=PWM_N_MOSFET_1 PWM_P=PWM_1_P Source=AC_CURR_SENS_IP-
MOSFET_3: designators end in _MOSFET_3; ports +5V=+5V +12V=+12V Drain=AC_CURR_SENS_IP- GND=GND PWM_N=PWM_N_MOSFET_3 PWM_P=PWM_3_P Source=HVGND
MOSFET_2: designators end in _MOSFET_2; ports +5V=+5V +12V=+12V Drain=Drain GND=GND PWM_N=PWM_N_MOSFET_2 PWM_P=PWM_2_P Source=AC_N_SENS
MOSFET_4: designators end in _MOSFET_4; ports +5V=+5V +12V=+12V Drain=AC_N_SENS GND=GND PWM_N=PWM_N_MOSFET_4 PWM_P=PWM_4_P Source=HVGND
MOSFET_5: designators end in _MOSFET_5; ports +5V=+5V +12V=+12V Drain=HVBUS GND=GND PWM_N=PWM_N_MOSFET_5 PWM_P=PWM_5_P Source=Drain
MOSFET_7: designators end in _MOSFET_7; ports +5V=+5V +12V=+12V Drain=Drain GND=GND PWM_N=PWM_N_MOSFET_7 PWM_P=PWM_7_P Source=HVGND
MOSFET_6: designators end in _MOSFET_6; ports +5V=+5V +12V=+12V Drain=HVBUS GND=GND PWM_N=PWM_N_MOSFET_6 PWM_P=PWM_6_P Source=DAB_IND_IP+
MOSFET_8: designators end in _MOSFET_8; ports +5V=+5V +12V=+12V Drain=DAB_IND_IP+ GND=GND PWM_N=PWM_N_MOSFET_8 PWM_P=PWM_8_P Source=HVGND
MOSFET_9: designators end in _MOSFET_9; ports +5V=+5V +12V=+12V Drain=BAT_IP+ GND=GND PWM_N=PWM_N_MOSFET_9 PWM_P=PWM_9_P Source=Drain
MOSFET_11: designators end in _MOSFET_11; ports +5V=+5V +12V=+12V Drain=Drain GND=GND PWM_N=PWM_N_MOSFET_11 PWM_P=PWM_11_P Source=BATGND
MOSFET_10: designators end in _MOSFET_10; ports +5V=+5V +12V=+12V Drain=BAT_IP+ GND=GND PWM_N=PWM_10_N PWM_P=PWM_10_P Source=Drain
MOSFET_12: designators end in _MOSFET_12; ports +5V=+5V +12V=+12V Drain=Drain GND=GND PWM_N=PWM_N_MOSFET_12 PWM_P=PWM_12_P Source=BATGND

### Notes on the sheet
- (in symbol UCC5320SCDWV) Isolation Barrier

### Library data of the parts
C1 C2 C5 C7 = CAPC0588: Capacitor Ceramic 10uF 50V 0805; Tolerance: %10; Value Rating: uF; Value: 10uF; Part Number: CAPC0588; Category: Capacitor Ceramic; Values: 10uF 50V
C3 C4 = CAPC0572: Capacitor Ceramic 100nF 50V 0805; Tolerance: %10; Value Rating: nF; Favorites: Favorite; Value: 100nF; Part Number: CAPC0572; Category: Capacitor Ceramic; Values: 100nF 50V
C6 C8 C9 = CAPC0584: Capacitor Ceramic 4.7uF 50V 0805; Tolerance: %10; Value Rating: uF; Value: 4.7uF; Part Number: CAPC0584; Category: Capacitor Ceramic; Values: 4.7uF 50V
C10 = 8853620100181: WCAP-CSSA Multilayer Ceramic Chip Safety Capacitor, SMT, size 1808, NP0 Class I, 220 pF, 250 V (AC); Manufacturer: Wurth Elektronik; Case/Size Code: 1808; Capacitance Tolerance: ±5%; Dissipation Factor: 0.1%; Impulse Voltage: 2500 V (DC); Insulation Resistance: 100 GΩ; Safety Class: X2; Manufacturer Part Number: 8853620100181; Category: Multilayer Ceramic Chip Capacitors; Match Code: WCAP-CSSA; ComponentLink1Description: Website Link; ComponentLink1URL: https://www.we-online.com/redexpert/article/8853620100181?ad; ComponentLink2Description: Datasheet Link; ComponentLink2URL: https://www.we-online.com/redexpert/spec/8853620100181?ad; Mount: Surface Mount; Min Operating Temperature: -55 °C; Max Operating Temperature: 125 °C; Packaging: Tape and Reel; Length: 4.5 mm; Width: 2 mm; Height: 2 mm; Capacitance: 220 pF; Ceramic Type: NP0 Class I; Rated Voltage: 250 V (AC)
C30 = CAPC0644: Capacitor Ceramic 2.2nF 25V 0805; Tolerance: %10; Value Rating: nF; Value: 2.2nF; Part Number: CAPC0644; Category: Capacitor Ceramic; Values: 2.2nF 25V
D1 = SZMMSZ3V3T1G: 500 mW Rating on FR-4 or FR-5 Board; Wide Zener Reverse Voltage Range - 2.4 V to 56 V; Package Designed for Optimal Automated Board Assembly; Small Package Size for High Density Applications; ESD Rating of Class 3 (exceeding 16 kV) per the Human Body Model Mechanical Characteristics:; CASE: Void-free, transfer-molded, thermosetting plastic case; FINISH: Corrosion resistant finish, easily solderable; MAXIMUM CASE TEMPERATURE FOR SOLDERING PURPOSES: 260C for 10 Seconds; POLARITY: Cathode indicated by polarit; Manufacturer_Name: onsemi; Geometry.Height: 1.35mm; Mouser Part Number: 863-SZMMSZ3V3T1G; Mouser Price/Stock: https://www.mouser.co.uk/ProductDetail/onsemi/SZMMSZ3V3T1G?qs=PJJcWtbOkNWDWixFbpUCfA%3D%3D; Manufacturer_Part_Number: SZMMSZ3V3T1G; Datasheet Link: https://www.onsemi.com/pub/Collateral/MMSZ2V4T1-D.PDF
D2 = 150080RS75000: WL-SMCW Mono-color Chip LED Waterclear, SMT, size 0805, Red, 2V, 140°; Manufacturer: Wurth Elektronik; Case/Size Code: 0805; Chip Technology: AlInGaP; Dominant Wavelength: 625nm; Luminous Intensity: 150mcd; Peak Wavelength: 630nm; Manufacturer Part Number: 150080RS75000; Category: Signal LEDs; Match Code: WL-SMCW; ComponentLink1Description: Website Link; ComponentLink1URL: https://www.we-online.com/redexpert/article/150080RS75000?ad; ComponentLink2Description: Datasheet Link; ComponentLink2URL: https://www.we-online.com/redexpert/spec/150080RS75000?ad; Mount: Surface Mount; Min Operating Temperature: -40°C; Max Operating Temperature: 85°C; Packaging: Tape and Reel; Length: 2mm; Width: 1.25mm; Height: 0.7mm; Emitting Color: Red; Forward Voltage: 2V; Viewing Angle: 140°
L1 = 7447785006: WE-PD SMT Power Inductor, size 6033R, 6.8μH, 2.3A, 100mΩ; Manufacturer: Wurth Elektronik; DC Resistance: 79mΩ; Saturation Current: 2A; Self Resonant Frequency: 45MHz; Type: Robust; Manufacturer Part Number: 7447785006; Category: Power Inductors; Match Code: WE-PD; ComponentLink1Description: Website Link; ComponentLink1URL: https://www.we-online.com/redexpert/article/7447785006?ad; ComponentLink2Description: Datasheet Link; ComponentLink2URL: https://www.we-online.com/redexpert/spec/7447785006?ad; Mount: Surface Mount; Min Operating Temperature: -40°C; Max Operating Temperature: 125°C; Packaging: Tape and Reel; Case/Size Code: 6033R; Length: 5.9mm; Width: 6.2mm; Height: 3.3mm; DC Resistance Max: 100mΩ; Inductance: 6.8μH; Rated Current: 2.3A
Q1 = IMZA65R026M2H: Insulated-Gate Field-Effect Transistor (IGFET), N-Channel, Enhancement, Body Diode, Pin 1 Drain, 2 Power Source,  3 Driver Source, 4 Gate, 4 Pins; Manufacturer: Infineon Technologies; Manufacturer Order Number: IMZA65R026M2H; PackageReference: PG-TO247-4-8
R1 = R0354: 3.3K 0805; Part Number: R0354; Tolerance: %5; Power: 1/10W; Value: 3.3K; Category: Resistor; Values: 3.3K
R2 R5 = R0295: 10R 0805; Part Number: R0295; Tolerance: %5; Power: 1/10W; Value: 10R; Category: Resistor; Values: 10R
R3 = R0312: 56R 0805; Part Number: R0312; Tolerance: %5; Power: 1/10W; Value: 56R; Category: Resistor; Values: 56R
R7 = R0344: 1.2K 0805; Part Number: R0344; Tolerance: %5; Power: 1/10W; Value: 1.2K; Category: Resistor; Values: 1.2K
U1 = UCC5320SCDWV: 3k/5kVrms, 2A/2A single-channel isolated gate driver with UVLO referenced to GND or split output 8-SOIC -40 to 125; Manufacturer_Name: Texas Instruments; TYPE: TYPE; RefDes: RefDes; Copyright: Copyright (C) 2025 Ultra Librarian. All rights reserved.; Manufacturer_Part_Number: UCC5320SCDWV; Datasheet: https://www.ti.com/lit/gpn/ucc5320
PS1 = B_S-1WR3: Datasheet_Link: https://www.mornsun-power.com/html/pdf/B1224S-1WR3.html; Supply_Link: https://www.motorobit.com/b1224s-1wr3-dc-dc-1w-108-132v-giris-24v-cikis-voltaj-donusturucu

## Sheet Voltage_Sens.SchDoc
size A4; SheetNumber: 4; SheetTotal: 5; SPICEModelCacheLAJQXVES: <root> / <DocumentId>LAJQXVES</DocumentId> / <CacheFrame Number="0"> / <Model Name="3818_74406032220_22u" Kind="CKT"> / <Text>******* / .subckt 3818_74406032220_22u 1 2 / Rp 1 2 9156.93522 / Cp 1 2 0.884349082p / Rs 1 N3 0.401 / L1 N3 2 22.9186456u / .ends 3818_74406032220_22u</Text> / </Model> / </CacheFrame> / </root>
Used 3 times, as channels AC_Voltage_Sens, HV_Voltage_Sens, BAT_Voltage_Sens. Parts and nets are listed once, with the designators drawn on the sheet.
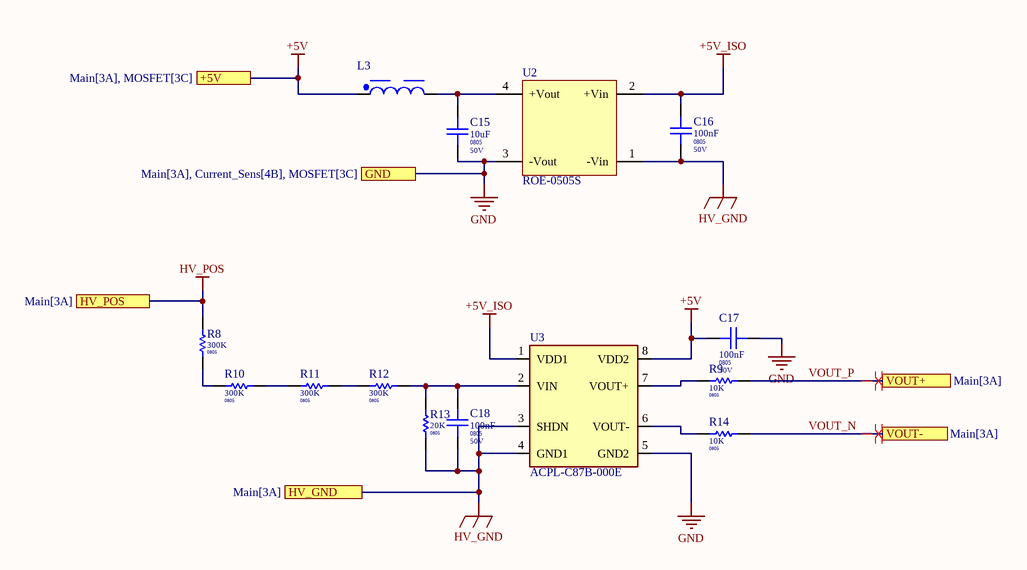
[diagram p3: Voltage_Sens.SchDoc]

### Parts
C15  Package / Case: 0805  Voltage: 50V  [CAPC 0805]  (hidden comment: 10uF)
C16  Package / Case: 0805  Voltage: 50V  [CAPC 0805]  (hidden comment: 100nF)
C17  Package / Case: 0805  Voltage: 50V  [CAPC 0805]  (hidden comment: 100nF)
C18  Package / Case: 0805  Voltage: 50V  [CAPC 0805]  (hidden comment: 100nF)
L3  22uH, 0.66A  [WE-LQFS_3818]  (value not drawn)
R8  Package / Case: 0805  [RESC 0805]  (hidden comment: 300K)
R9  Package / Case: 0805  [RESC 0805]  (hidden comment: 10K)
R10  Package / Case: 0805  [RESC 0805]  (hidden comment: 300K)
R11  Package / Case: 0805  [RESC 0805]  (hidden comment: 300K)
R12  Package / Case: 0805  [RESC 0805]  (hidden comment: 300K)
R13  Package / Case: 0805  [RESC 0805]  (hidden comment: 20K)
R14  Package / Case: 0805  [RESC 0805]  (hidden comment: 10K)
U2  ROE-0505S  [CONV_ROE-0505S]
U3  ACPL-C87B-000E  [SOIC127P1150X320-8N]

### Ports
+5V (see Main[3A], MOSFET[3C]), GND (see Main[3A], Current_Sens[4B], MOSFET[3C]), HV_GND (see Main[3A]), HV_POS (see Main[3A]), VOUT+ (see Main[3A]), VOUT- (see Main[3A])

### Nets
+5V: C17.2 L3.1 U3.8(VDD2) ; port +5V
+5V_ISO: C16.2 U2.2(+Vin) U3.1(VDD1)
GND: C15.1 C17.1 U2.3(-Vout) U3.5(GND2) ; port GND
HV_GND: C16.1 C18.1 R13.1 U2.1(-Vin) U3.3(SHDN) U3.4(GND1) ; port HV_GND
HV_POS: R8.2 ; port HV_POS
VOUT_N: R14.2 ; port VOUT-
VOUT_P: R9.2 ; port VOUT+
NetC15_2: C15.2 L3.2 U2.4(+Vout)
NetC18_2: C18.2 R12.1 R13.2 U3.2(VIN)
NetR8_1: R8.1 R10.2
NetR9_1: R9.1 U3.7(VOUT+)
NetR10_1: R10.1 R11.2
NetR11_1: R11.1 R12.2
NetR14_1: R14.1 U3.6(VOUT-)

### Channels
AC_Voltage_Sens: designators end in _AC_Voltage_Sens; ports +5V=+5V GND=GND HV_GND=AC_N_SENS HV_POS=AC_L_SENS VOUT+=AC_V_SENS_P VOUT-=AC_V_SENS_N
HV_Voltage_Sens: designators end in _HV_Voltage_Sens; ports +5V=+5V GND=GND HV_GND=HVGND HV_POS=HVBUS VOUT+=HV_V_SENS_P VOUT-=HV_V_SENS_N
BAT_Voltage_Sens: designators end in _BAT_Voltage_Sens; ports +5V=+5V GND=GND HV_GND=BATGND HV_POS=BAT+ VOUT+=BAT_V_SENS_P VOUT-=BAT_V_SENS_N

### Layout directives
differential pair: AC_V_SENS_N, AC_V_SENS_P

### Library data of the parts
C15 = CAPC0588: as C1 on sheet MOSFET; Value: 10uF; Part Number: CAPC0588; Category: Capacitor Ceramic; Values: 10uF 50V
C16-C18 = CAPC0572: as C3 on sheet MOSFET; Value: 100nF; Part Number: CAPC0572; Category: Capacitor Ceramic; Values: 100nF 50V
L3 = 74406032220: WE-LQFS SMT Power Inductor, size 3818, 22uH, 0.66A, 481mOhm; Manufacturer: Wurth Elektronik; Case/Size Code: 3818; DC Resistance: 401mOhm; Saturation Current: 0.46A; Self Resonant Frequency: 37MHz; Manufacturer Part Number: 74406032220; Category: Power Inductors; Match Code: WE-LQFS; ComponentLink1Description: Website Link; ComponentLink1URL: https://www.we-online.com/redexpert/article/74406032220?ad; ComponentLink2Description: Datasheet Link; ComponentLink2URL: https://www.we-online.com/redexpert/spec/74406032220?ad; Mount: Surface Mount; Min Operating Temperature: -40°C; Max Operating Temperature: 125°C; Packaging: Tape and Reel; Length: 3.8mm; Width: 3.8mm; Height: 1.8mm; DC Resistance Max: 481mOhm; Inductance: 22uH; Rated Current: 0.66A
R8 R10-R12 = R0401: 300K 0805; Part Number: R0401; Tolerance: %5; Power: 1/10W; Value: 300K; Category: Resistor; Values: 300K
R9 R14 = R0366: 10K 0805; Part Number: R0366; Tolerance: %5; Power: 1/10W; Value: 10K; Category: Resistor; Values: 10K
R13 = R0373: 20K 0805; Part Number: R0373; Tolerance: %5; Power: 1/10W; Value: 20K; Category: Resistor; Values: 20K
U2 = ROE-0505S: DC DC CONVERTER 5V 1W; Manufacturer 1: Recom; Manufacturer Part Number 1: ROE-1205S; Number of Outputs: 1; Min Input Voltage: 10.8V; Max Input Voltage: 13.2V; Max Output Current: 200mA; Isolation Voltage: 1kV; Efficiency: 80%; Supplier 1: Digi-Key; Description 1: DC DC CONVERTER 5V 1W; Stock 1: 1769; Pricing 1: 1=2,94000, 5=2,89800, 10=2,85600, 25=2,77200, 50=2,68800, 100=2,60400, 250=2,52000, 500=2,35200 (USD); RoHS: Yes; Mount: Through Hole; Case/Package: SIP; Weight: 1.4g; Min Operating Temperature: -40°C; Max Operating Temperature: 85°C; Packaging: Rail/Tube; Voltage - Output 1: 5V; Max Power Dissipation: 1W; Max Output Voltage: 5V; Length: 11.5mm; Height: 10mm; Width: 6mm; Lead Free: Lead Free; ComponentLink1URL: http://www.farnell.com/datasheets/1960995.pdf?src-supplier=Newark; ComponentLink1Description: http://www.farnell.com/datasheets/1960995.pdf?src-supplier=Newark; ComponentLink2URL: https://www.recom-power.com/pdf/Econoline/ROE.pdf?src-supplier=Digi-Key; ComponentLink2Description: https://www.recom-power.com/pdf/Econoline/ROE.pdf?src-supplier=Digi-Key; Supplier Part Number 1: ROE-1205S-ND
U3 = ACPL-C87B-000E: Isolation Amplifier 1 Circuit Differential 8-SO; MF: Broadcom Limited; SnapEDA_Link: https://www.snapeda.com/parts/ACPL-C87B-000E/Broadcom%20Limited/view-part/1969988/?ref=snap; Availability: Unavailable; MP: ACPL-C87B-000E; Value: *; Price: None; Package: SO-8 Broadcom

## Sheet Current_Sens.SchDoc
size A4; SheetNumber: 5; SheetTotal: 5
Used 3 times, as channels AC_CURRENT_SENS, IND_CURRENT_SENS, BAT_CURRENT_SENS. Parts and nets are listed once, with the designators drawn on the sheet.
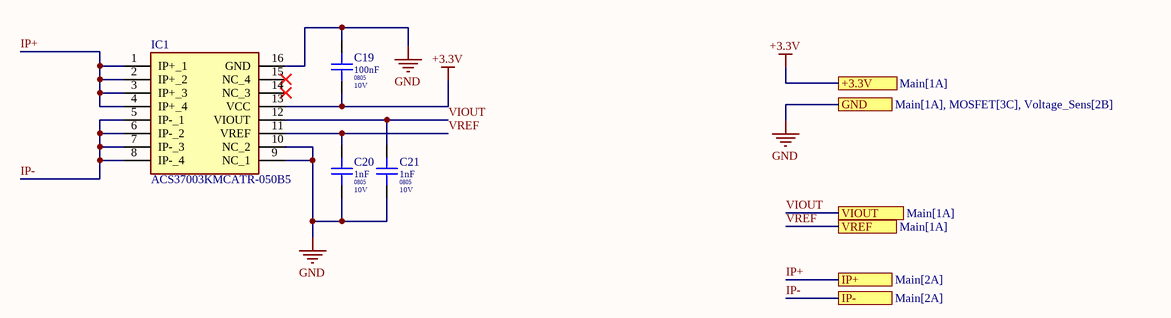
[diagram p4: Current_Sens.SchDoc]

### Parts
C19  Package / Case: 0805  Voltage: 10V  [CAPC 0805]  (hidden comment: 100nF)
C20  Package / Case: 0805  Voltage: 10V  [CAPC 0805]  (hidden comment: 1nF)
C21  Package / Case: 0805  Voltage: 10V  [CAPC 0805]  (hidden comment: 1nF)
IC1  ACS37003KMCATR-050B5  [ACS37002LMCA050U5]

### Ports
+3.3V (see Main[1A]), GND (see Main[1A], MOSFET[3C], Voltage_Sens[2B]), IP+ (see Main[2A]), IP- (see Main[2A]), VIOUT (see Main[1A]), VREF (see Main[1A])

### Nets
+3.3V: C19.1 IC1.13(VCC) ; port +3.3V
GND: C19.2 C20.1 C21.1 IC1.9(NC_1) IC1.10(NC_2) IC1.16(GND) ; port GND
IP+: IC1.1(IP+_1) IC1.2(IP+_2) IC1.3(IP+_3) IC1.4(IP+_4) ; port IP+
IP-: IC1.5(IP-_1) IC1.6(IP-_2) IC1.7(IP-_3) IC1.8(IP-_4) ; port IP-
VIOUT: C21.2 IC1.12(VIOUT) ; port VIOUT
VREF: C20.2 IC1.11(VREF) ; port VREF

Not connected (* = marked no-connect by the designer): IC1 14(NC_3)* 15(NC_4)*

### Channels
AC_CURRENT_SENS: designators end in _AC_CURRENT_SENS; ports +3.3V=+3.3V GND=GND IP+=AC_CURR_SENS_IP+ IP-=AC_CURR_SENS_IP- VIOUT=AC_CURR_P VREF=AC_CURR_N
IND_CURRENT_SENS: designators end in _IND_CURRENT_SENS; ports +3.3V=+3.3V GND=GND IP+=DAB_IND_IP+ IP-=DAB_IND_IP- VIOUT=IND_CURR_P VREF=IND_CURR_N
BAT_CURRENT_SENS: designators end in _BAT_CURRENT_SENS; ports +3.3V=+3.3V GND=GND IP+=BAT_IP+ IP-=BAT_IP- VIOUT=BAT_CURR_P VREF=BAT_CURR_N

### Library data of the parts
C19 = CAPC0744: Capacitor Ceramic 100nF 10V 0805; Tolerance: %10; Value Rating: nF; Value: 100nF; Part Number: CAPC0744; Category: Capacitor Ceramic; Values: 100nF 10V
C20 C21 = CAPC0728: Capacitor Ceramic 1nF 10V 0805; Tolerance: %10; Value Rating: nF; Values: 1nF 10V; Value: 1nF; Part Number: CAPC0728; Category: Capacitor Ceramic
IC1 = ACS37003KMCATR-050B5: Integrated Circuit; Manufacturer_Name: Allegro Microsystems; Datasheet Link: https://www.allegromicro.com/~/media/files/datasheets/acs37003mc-datasheet.pdf; Height: 3.285mm; Manufacturer_Part_Number: ACS37003KMCATR-050B5; Mouser Part Number: 250-03KMCATR-050B5; Mouser Price/Stock: https://www.mouser.co.uk/ProductDetail/Allegro-MicroSystems/ACS37003KMCATR-050B5?qs=e8oIoAS2J1SA8AOU7XDYIg%3D%3D; Arrow Part Number: ACS37003KMCATR-050B5; Arrow Price/Stock: https://www.arrow.com/en/products/acs37003kmcatr-050b5/allegro-microsystems?utm_currency=USD&region=nac

## Nets that join several sheets
+3.3V: Main (P3.6 P3.8), AC_CURRENT_SENS (C19_AC_CURRENT_SENS.1 IC1_AC_CURRENT_SENS.13), IND_CURRENT_SENS (C19_IND_CURRENT_SENS.1 IC1_IND_CURRENT_SENS.13), BAT_CURRENT_SENS (C19_BAT_CURRENT_SENS.1 IC1_BAT_CURRENT_SENS.13)
+5V: Main (P3.2 P3.4), MOSFET_1 (C1_MOSFET_1.1 C3_MOSFET_1.1 U1_MOSFET_1.1), AC_Voltage_Sens (C17_AC_Voltage_Sens.2 L3_AC_Voltage_Sens.1 U3_AC_Voltage_Sens.8), MOSFET_3 (C1_MOSFET_3.1 C3_MOSFET_3.1 U1_MOSFET_3.1), MOSFET_2 (C1_MOSFET_2.1 C3_MOSFET_2.1 U1_MOSFET_2.1), MOSFET_4 (C1_MOSFET_4.1 C3_MOSFET_4.1 U1_MOSFET_4.1), MOSFET_5 (C1_MOSFET_5.1 C3_MOSFET_5.1 U1_MOSFET_5.1), MOSFET_7 (C1_MOSFET_7.1 C3_MOSFET_7.1 U1_MOSFET_7.1), MOSFET_6 (C1_MOSFET_6.1 C3_MOSFET_6.1 U1_MOSFET_6.1), MOSFET_8 (C1_MOSFET_8.1 C3_MOSFET_8.1 U1_MOSFET_8.1), MOSFET_9 (C1_MOSFET_9.1 C3_MOSFET_9.1 U1_MOSFET_9.1), MOSFET_11 (C1_MOSFET_11.1 C3_MOSFET_11.1 U1_MOSFET_11.1), MOSFET_10 (C1_MOSFET_10.1 C3_MOSFET_10.1 U1_MOSFET_10.1), MOSFET_12 (C1_MOSFET_12.1 C3_MOSFET_12.1 U1_MOSFET_12.1), HV_Voltage_Sens (C17_HV_Voltage_Sens.2 L3_HV_Voltage_Sens.1 U3_HV_Voltage_Sens.8), BAT_Voltage_Sens (C17_BAT_Voltage_Sens.2 L3_BAT_Voltage_Sens.1 U3_BAT_Voltage_Sens.8)
+12V: Main (6 pins), MOSFET_1 (C8_MOSFET_1.2 L1_MOSFET_1.1), MOSFET_3 (C8_MOSFET_3.2 L1_MOSFET_3.1), MOSFET_2 (C8_MOSFET_2.2 L1_MOSFET_2.1), MOSFET_4 (C8_MOSFET_4.2 L1_MOSFET_4.1), MOSFET_5 (C8_MOSFET_5.2 L1_MOSFET_5.1), MOSFET_7 (C8_MOSFET_7.2 L1_MOSFET_7.1), MOSFET_6 (C8_MOSFET_6.2 L1_MOSFET_6.1), MOSFET_8 (C8_MOSFET_8.2 L1_MOSFET_8.1), MOSFET_9 (C8_MOSFET_9.2 L1_MOSFET_9.1), MOSFET_11 (C8_MOSFET_11.2 L1_MOSFET_11.1), MOSFET_10 (C8_MOSFET_10.2 L1_MOSFET_10.1), MOSFET_12 (C8_MOSFET_12.2 L1_MOSFET_12.1)
AC_L_SENS: Main (MP14.1), AC_Grid (C11.1 C13.2 L2.4), AC_Voltage_Sens (R8_AC_Voltage_Sens.2)
AC_N_SENS: AC_Grid (C11.2 C14.2 L2.3), AC_Voltage_Sens (6 pins), MOSFET_2 (Q1_MOSFET_2.2), MOSFET_4 (Q1_MOSFET_4.1)
BAT+: Main (F2.2 MP9.1), BAT_Voltage_Sens (R8_BAT_Voltage_Sens.2)
BATGND: Main (5 pins), MOSFET_11 (Q1_MOSFET_11.2), MOSFET_12 (Q1_MOSFET_12.2), BAT_Voltage_Sens (6 pins)
GND: Main (26 pins), MOSFET_1 (9 pins), AC_Voltage_Sens (C15_AC_Voltage_Sens.1 C17_AC_Voltage_Sens.1 U2_AC_Voltage_Sens.3 U3_AC_Voltage_Sens.5), MOSFET_3 (9 pins), MOSFET_2 (9 pins), MOSFET_4 (9 pins), MOSFET_5 (9 pins), MOSFET_7 (9 pins), MOSFET_6 (9 pins), MOSFET_8 (9 pins), MOSFET_9 (9 pins), MOSFET_11 (9 pins), MOSFET_10 (9 pins), MOSFET_12 (9 pins), AC_CURRENT_SENS (6 pins), IND_CURRENT_SENS (6 pins), BAT_CURRENT_SENS (6 pins), HV_Voltage_Sens (C15_HV_Voltage_Sens.1 C17_HV_Voltage_Sens.1 U2_HV_Voltage_Sens.3 U3_HV_Voltage_Sens.5), BAT_Voltage_Sens (C15_BAT_Voltage_Sens.1 C17_BAT_Voltage_Sens.1 U2_BAT_Voltage_Sens.3 U3_BAT_Voltage_Sens.5)
HVBUS: Main (6 pins), MOSFET_5 (Q1_MOSFET_5.1), MOSFET_6 (Q1_MOSFET_6.1), HV_Voltage_Sens (R8_HV_Voltage_Sens.2)
HVGND: Main (C24.2 C25.2 C26.2 C27.2), MOSFET_3 (Q1_MOSFET_3.2), MOSFET_4 (Q1_MOSFET_4.2), MOSFET_7 (Q1_MOSFET_7.2), MOSFET_8 (Q1_MOSFET_8.2), HV_Voltage_Sens (6 pins)
AC_CURR_N: Main (P1.3), AC_CURRENT_SENS (C20_AC_CURRENT_SENS.2 IC1_AC_CURRENT_SENS.11)
AC_CURR_P: Main (P1.1), AC_CURRENT_SENS (C21_AC_CURRENT_SENS.2 IC1_AC_CURRENT_SENS.12)
AC_CURR_SENS_IP+: Main (MP15.1), AC_CURRENT_SENS (IC1_AC_CURRENT_SENS.1 IC1_AC_CURRENT_SENS.2 IC1_AC_CURRENT_SENS.3 IC1_AC_CURRENT_SENS.4)
AC_CURR_SENS_IP-: MOSFET_1 (Q1_MOSFET_1.2), MOSFET_3 (Q1_MOSFET_3.1), AC_CURRENT_SENS (IC1_AC_CURRENT_SENS.5 IC1_AC_CURRENT_SENS.6 IC1_AC_CURRENT_SENS.7 IC1_AC_CURRENT_SENS.8)
AC_V_SENS_N: Main (P1.4), AC_Voltage_Sens (R14_AC_Voltage_Sens.2)
AC_V_SENS_P: Main (P1.2), AC_Voltage_Sens (R9_AC_Voltage_Sens.2)
BAT_CURR_N: Main (P6.3), BAT_CURRENT_SENS (C20_BAT_CURRENT_SENS.2 IC1_BAT_CURRENT_SENS.11)
BAT_CURR_P: Main (P6.1), BAT_CURRENT_SENS (C21_BAT_CURRENT_SENS.2 IC1_BAT_CURRENT_SENS.12)
BAT_IP+: MOSFET_9 (Q1_MOSFET_9.1), MOSFET_10 (Q1_MOSFET_10.1), BAT_CURRENT_SENS (IC1_BAT_CURRENT_SENS.1 IC1_BAT_CURRENT_SENS.2 IC1_BAT_CURRENT_SENS.3 IC1_BAT_CURRENT_SENS.4)
BAT_IP-: Main (5 pins), BAT_CURRENT_SENS (IC1_BAT_CURRENT_SENS.5 IC1_BAT_CURRENT_SENS.6 IC1_BAT_CURRENT_SENS.7 IC1_BAT_CURRENT_SENS.8)
BAT_V_SENS_N: Main (P6.4), BAT_Voltage_Sens (R14_BAT_Voltage_Sens.2)
BAT_V_SENS_P: Main (P6.2), BAT_Voltage_Sens (R9_BAT_Voltage_Sens.2)
DAB_IND_IP+: MOSFET_6 (Q1_MOSFET_6.2), MOSFET_8 (Q1_MOSFET_8.1), IND_CURRENT_SENS (IC1_IND_CURRENT_SENS.1 IC1_IND_CURRENT_SENS.2 IC1_IND_CURRENT_SENS.3 IC1_IND_CURRENT_SENS.4)
DAB_IND_IP-: Main (MP10.1), IND_CURRENT_SENS (IC1_IND_CURRENT_SENS.5 IC1_IND_CURRENT_SENS.6 IC1_IND_CURRENT_SENS.7 IC1_IND_CURRENT_SENS.8)
Drain: Main (MP17.1), MOSFET_5 (Q1_MOSFET_5.2), MOSFET_7 (Q1_MOSFET_7.1)
Drain: Main (MP13.1), MOSFET_10 (Q1_MOSFET_10.2), MOSFET_12 (Q1_MOSFET_12.1)
Drain: Main (MP16.1), MOSFET_9 (Q1_MOSFET_9.2), MOSFET_11 (Q1_MOSFET_11.1)
Drain: Main (R?#1.1 R?#2.3), MOSFET_1 (Q1_MOSFET_1.1), MOSFET_2 (Q1_MOSFET_2.1)
HV_V_SENS_N: Main (P4.4), HV_Voltage_Sens (R14_HV_Voltage_Sens.2)
HV_V_SENS_P: Main (P4.2), HV_Voltage_Sens (R9_HV_Voltage_Sens.2)
IND_CURR_N: Main (P4.3), IND_CURRENT_SENS (C20_IND_CURRENT_SENS.2 IC1_IND_CURRENT_SENS.11)
IND_CURR_P: Main (P4.1), IND_CURRENT_SENS (C21_IND_CURRENT_SENS.2 IC1_IND_CURRENT_SENS.12)
PWM_1_P: Main (P2.5), MOSFET_1 (R3_MOSFET_1.1)
PWM_2_P: Main (P2.9), MOSFET_2 (R3_MOSFET_2.1)
PWM_3_P: Main (P2.8), MOSFET_3 (R3_MOSFET_3.1)
PWM_4_P: Main (P2.4), MOSFET_4 (R3_MOSFET_4.1)
PWM_5_P: Main (P5.6), MOSFET_5 (R3_MOSFET_5.1)
PWM_6_P: Main (P5.2), MOSFET_6 (R3_MOSFET_6.1)
PWM_7_P: Main (P5.3), MOSFET_7 (R3_MOSFET_7.1)
PWM_8_P: Main (P5.7), MOSFET_8 (R3_MOSFET_8.1)
PWM_9_P: Main (P7.1), MOSFET_9 (R3_MOSFET_9.1)
PWM_10_P: Main (P7.5), MOSFET_10 (R3_MOSFET_10.1)
PWM_11_P: Main (P7.2), MOSFET_11 (R3_MOSFET_11.1)
PWM_12_P: Main (P7.6), MOSFET_12 (R3_MOSFET_12.1)